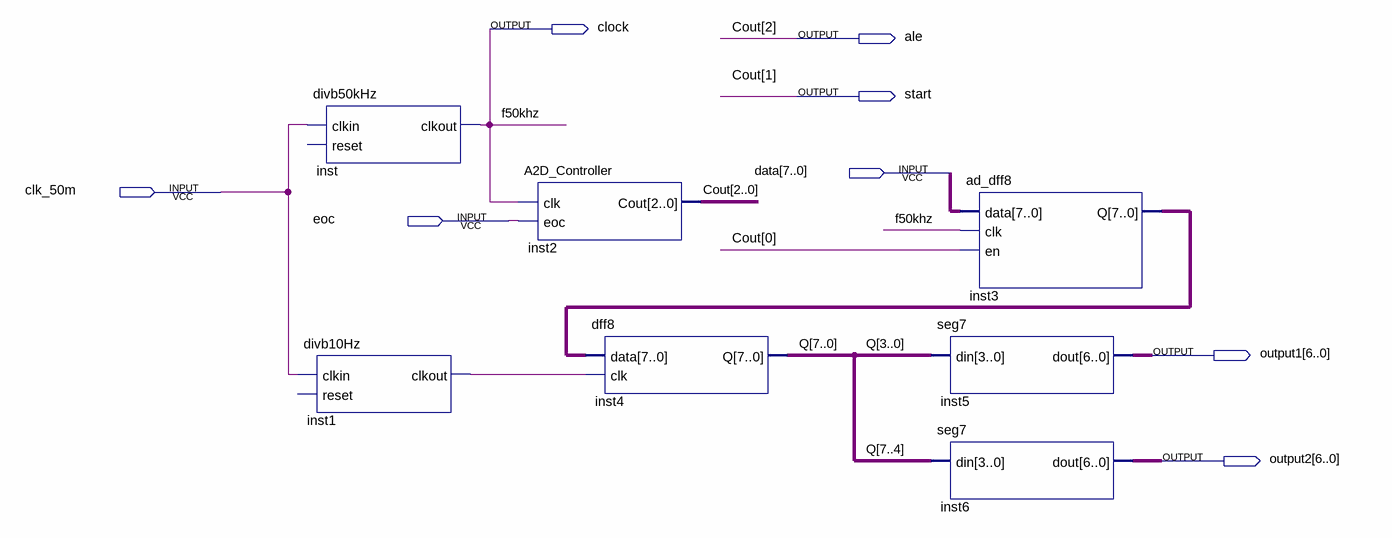
[diagram p0: schematic sheet]
// Quartus schematic week5.bdf as structural Verilog: 7 symbols, 8 pins
module week5 (
  input  [7:0] data,
  input  clk_50m,
  input  eoc,
  output clock,
  output ale,
  output start,
  output [6:0] output1,
  output [6:0] output2
);

  wire inst1_clkout;
  wire [0:0] Cout;
  wire [7:0] inst3_q, Q;

  divb50kHz inst (.clkin(clk_50m), .clkout(clock));  // open: reset
  divb10Hz inst1 (.clkin(clk_50m), .clkout(inst1_clkout));  // open: reset
  A2D_Controller inst2 (.clk(clock), .eoc(eoc), .Cout({ale, start, Cout[0]}));
  dff8 inst4 (.data(inst3_q), .clk(inst1_clkout), .Q(Q));
  seg7 inst5 (.din(Q[3:0]), .dout(output1));
  seg7 inst6 (.din(Q[7:4]), .dout(output2));
  ad_dff8 inst3 (.data(data), .clk(clock), .en(Cout[0]), .Q(inst3_q));

  // Other names for the same wires on the sheet: f50khz = clock; Cout[2:1] = {ale, start}
endmodule
